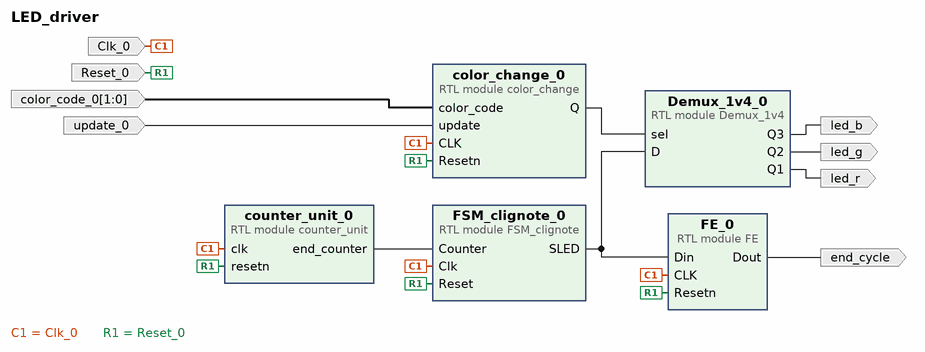
[diagram p0: block diagram of the top level]
# Vivado block design LED_driver, xc7z010clg400-1, Vivado 2024.1
create_bd_design LED_driver

create_bd_port -dir I -type clk Clk_0
create_bd_port -dir I -type rst Reset_0
create_bd_port -dir O led_r
create_bd_port -dir O led_g
create_bd_port -dir O led_b
create_bd_port -dir I -from 1 -to 0 color_code_0
create_bd_port -dir I update_0
create_bd_port -dir O end_cycle

create_bd_cell -type module -reference counter_unit counter_unit_0
set_property -dict {CONFIG.max 100000000} [get_bd_cells counter_unit_0]
create_bd_cell -type module -reference FSM_clignote FSM_clignote_0
create_bd_cell -type module -reference Demux_1v4 Demux_1v4_0
create_bd_cell -type module -reference color_change color_change_0
create_bd_cell -type module -reference FE FE_0

# ---- connections ----

connect_bd_net -net Clk_0_1 [get_bd_ports Clk_0] \
  [get_bd_pins counter_unit_0/clk] [get_bd_pins FSM_clignote_0/Clk] [get_bd_pins color_change_0/CLK] [get_bd_pins FE_0/CLK]
connect_bd_net [get_bd_pins Demux_1v4_0/Q1] [get_bd_ports led_r]
connect_bd_net [get_bd_pins Demux_1v4_0/Q2] [get_bd_ports led_g]
connect_bd_net [get_bd_pins Demux_1v4_0/Q3] [get_bd_ports led_b]
connect_bd_net [get_bd_pins FE_0/Dout] [get_bd_ports end_cycle]
connect_bd_net [get_bd_pins FSM_clignote_0/SLED] [get_bd_pins Demux_1v4_0/D] [get_bd_pins FE_0/Din]
connect_bd_net -net Reset_0_1 [get_bd_ports Reset_0] \
  [get_bd_pins counter_unit_0/resetn] [get_bd_pins FSM_clignote_0/Reset] [get_bd_pins color_change_0/Resetn] \
  [get_bd_pins FE_0/Resetn]
connect_bd_net [get_bd_pins color_change_0/Q] [get_bd_pins Demux_1v4_0/sel]
connect_bd_net -net color_code_0_1 [get_bd_ports color_code_0] [get_bd_pins color_change_0/color_code]
connect_bd_net [get_bd_pins counter_unit_0/end_counter] [get_bd_pins FSM_clignote_0/Counter]
connect_bd_net -net update_0_1 [get_bd_ports update_0] [get_bd_pins color_change_0/update]

validate_bd_design
save_bd_design
